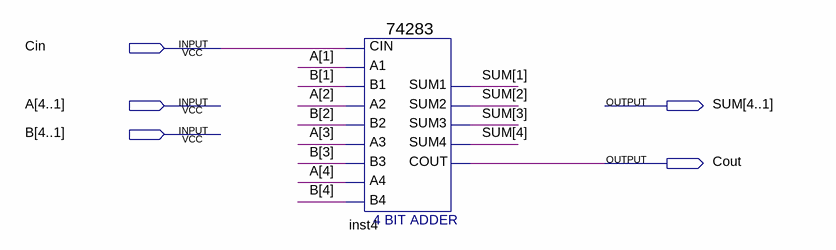
[diagram p0: schematic sheet]
// Quartus schematic superAdder4.bdf as structural Verilog: 1 symbols, 5 pins
module superAdder4 (
  input  Cin,
  input  [4:1] A,
  input  [4:1] B,
  output [4:1] SUM,
  output Cout
);

  \74283  inst4 (
    .CIN(Cin), .A1(A[1]), .A2(A[2]), .B2(B[2]), .A3(A[3]), .A4(A[4]), .B4(B[4]), .B1(B[1]), .B3(B[3]),
    .SUM4(SUM[4]), .COUT(Cout), .SUM1(SUM[1]), .SUM2(SUM[2]), .SUM3(SUM[3]));
endmodule
